# Altium schematic sheet Power.SchDoc
size A4
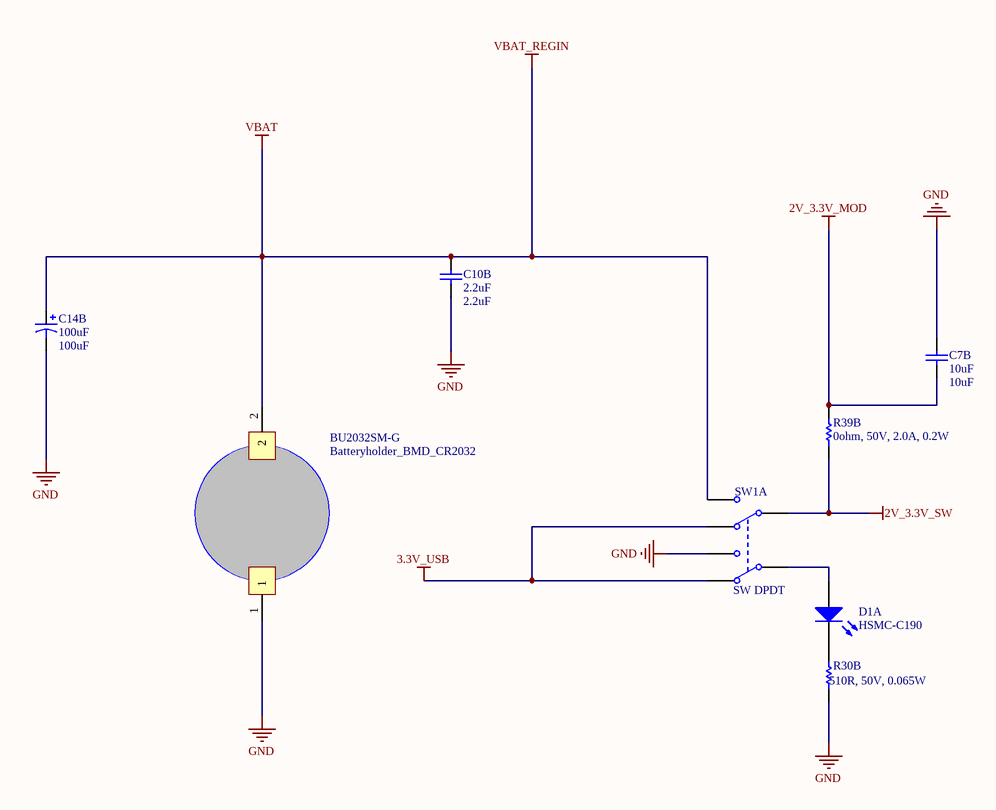
[diagram p0: Power.SchDoc]

## Parts
BU2032SM-G  Batteryholder_BMD_CR2032  [Batteryholder_BMD_CR2032]
C7B  10uF  [C0805]
C10B  2.2uF  [C0805]
C14B  100uF  [C0805]
D1A  HSMC-C190  [1.6X0.8X0.8]
R30B  510R, 50V, 0.065W  [ERA-0805]
R39B  0ohm, 50V, 2.0A, 0.2W  [ERA-0805]
SW1A  SW DPDT  [JS202011SCQN]

## Nets
2V_3.3V_MOD: C7B.1 R39B.2
2V_3.3V_SW: R39B.1 SW1A.5(COMMON2)
3.3V_USB: SW1A.2(NC1) SW1A.4(NC2)
GND: BU2032SM-G.1 C7B.2 C10B.1 C14B.2 R30B.1 SW1A.3(NO1)
VBAT: BU2032SM-G.2 C10B.2 C14B.1 SW1A.6(NO2)  [also labelled VBAT_REGIN]
NetD1A_1: D1A.1(A) SW1A.1(COMMON1)
NetD1A_2: D1A.2(K) R30B.2

## Library data of the parts
C7B C10B = Cap Semi: Capacitor (Semiconductor SIM Model); Published: 8-Jun-2000; LatestRevisionDate: 29-May-2009; LatestRevisionNote: IPC-7351 Footprint Added.; PackageReference: C1206; Publisher: Altium Limited; PackageDescription: Chip Capacitor
  C7B: Value: 10uF
  C10B: Value: 2.2uF
C14B = Cap Pol3: Polarized Capacitor (Surface Mount); Published: 8-Jun-2000; LatestRevisionDate: 29-May-2009; LatestRevisionNote: IPC-7351 Footprint Added.; PackageReference: C0805; Publisher: Altium Limited; PackageDescription: Chip Capacitor; Value: 100uF
D1A = HSMC-C190: High Performance Chip LED, Red; LuminousIntensity: 25mcd (Minimum).; PCB_Layout: Complies with manufacturer's recommendation.; Published: 11-Dec-2002; DatasheetDocument: 11-Mar-2002; PackageDocument: 11-Mar-2002; PackageReference: 1.6X0.8X0.8; Publisher: Altium Limited; LED_Colour: Red; ComponentLink1Description: Manufacturer Link; ComponentLink1URL: http://www.agilent.com/; ComponentLink2Description: Datasheet; ComponentLink2URL: http://cp.literature.agilent.com/litweb/pdf/5988-5891EN.pdf
R30B R39B = ERAS: Metal Film Thermosensitive Chip Resistor, 0.56 Ohm to 10k Ohm Range, 5% Tolerance, 0805 Size, 0.1 W; Note: If flow soldering, adjust pad width of PCB Footprint to 0.7 - 0.8 times the width of the resistor.; Published: 17-Dec-2003; LatestRevisionDate: 19-Mar-2004; LatestRevisionNote: Silkscreen size reduced.; PackageReference: ERA-0805; Publisher: Altium Limited; PackageDocument: Mar-2003; Code_IPC: 2012 [0805]; ComponentLink1Description: Manufacturer Link; ComponentLink1URL: http://www.panasonic.com/industrial/components/resistive_products.htm; ComponentLink2Description: Datasheet; ComponentLink2URL: http://www.panasonic.com/industrial/components/pdf/AOF0000CE1.pdf
SW1A = SW DPDT: Switch; Published: 24-Mar-1999; LatestRevisionDate: 29-May-2009; LatestRevisionNote: IPC-7351 Footprint Added.; PackageVersion: Mar-2001; PackageReference: SOT23-6; Publisher: Altium Limited; PackageDescription: 6-Pin SOT-23 Package 0.95 mm Pitch, 2.7 mm Lead Span; Code_JEITA: SC-74; Code_IPC: SOT26A-6